# EAGLE design ws2812-attiny (EAGLE 7.7.0)
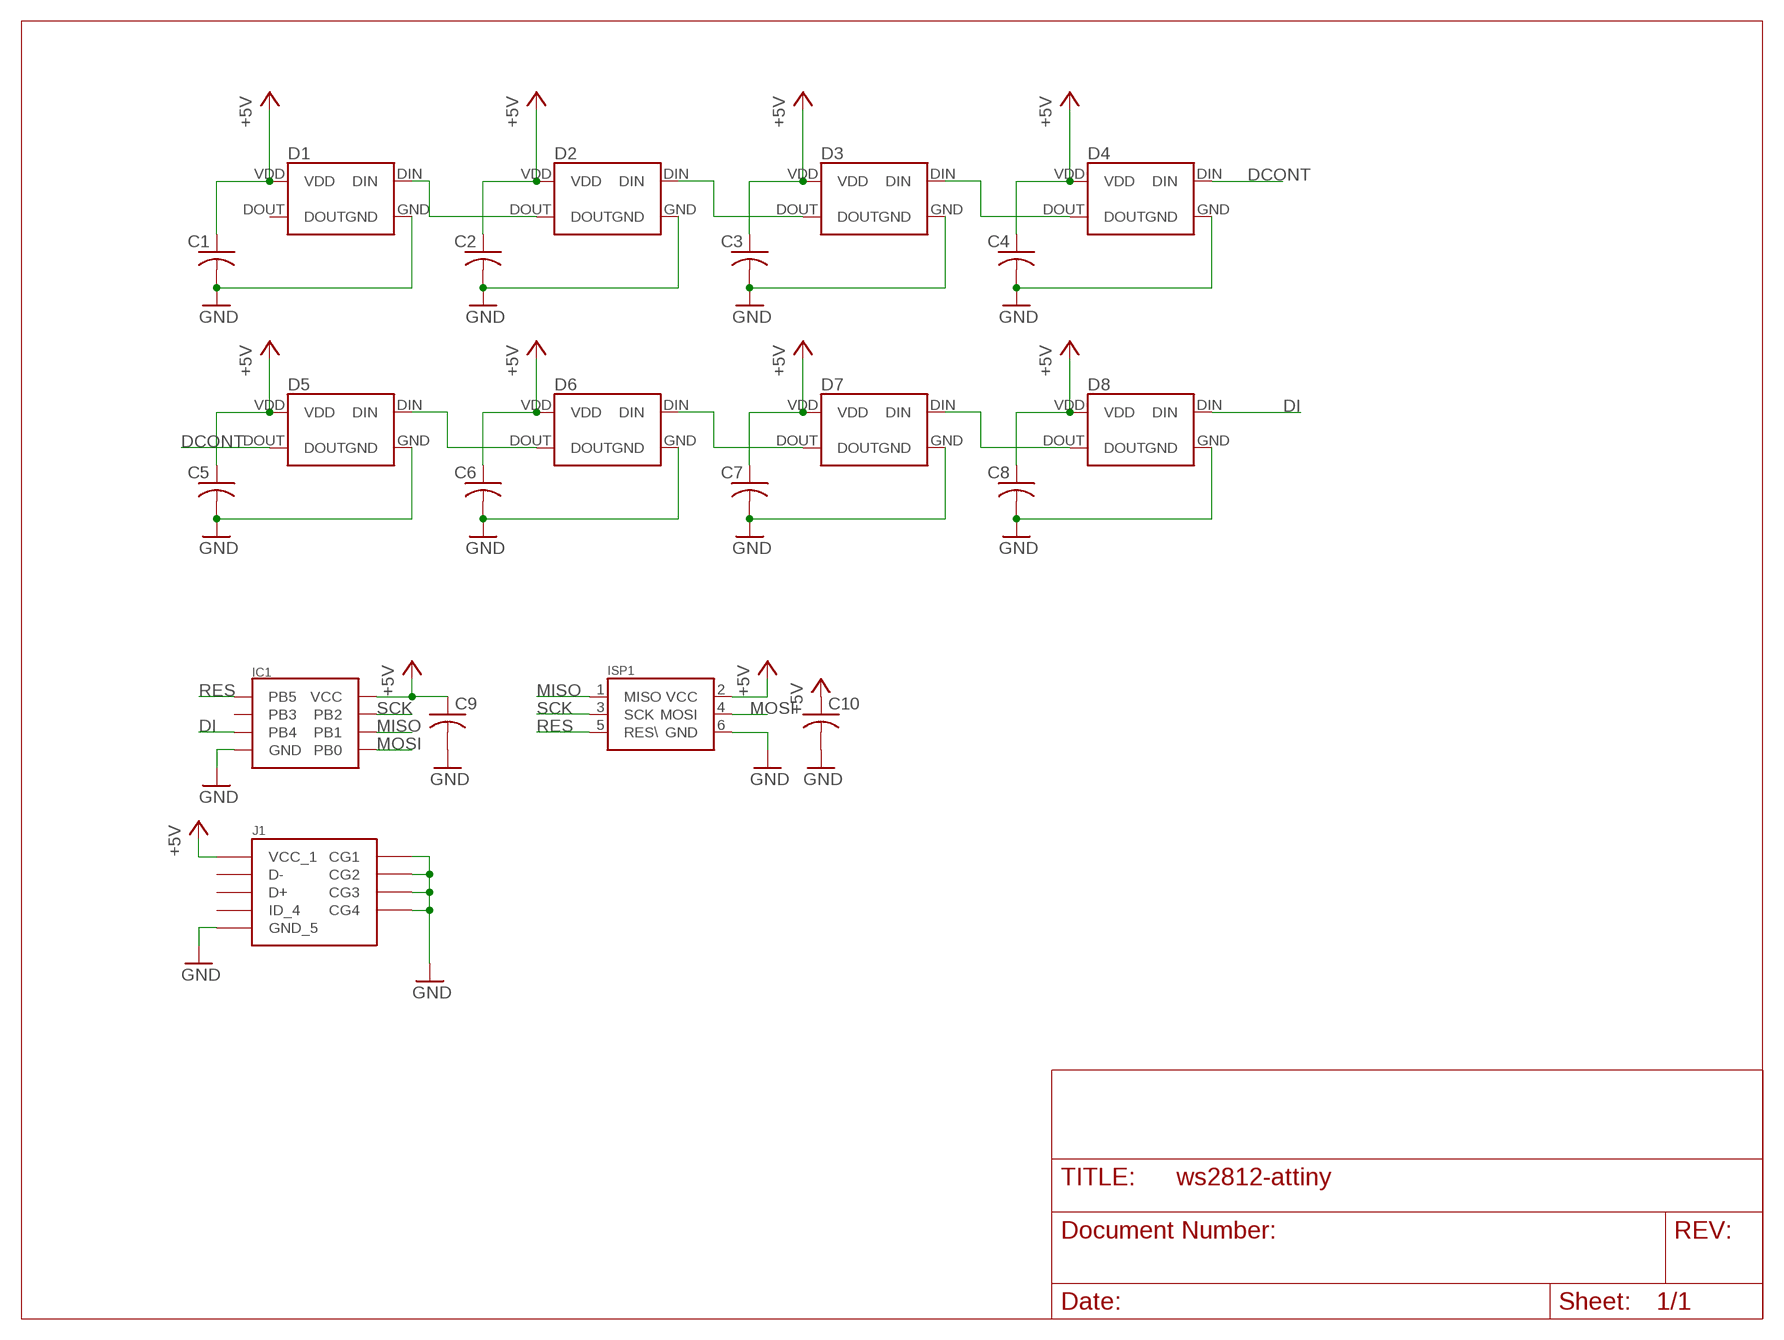
[diagram p0: schematic, sheet 1]

## Parts
C1  C-USC1206  [C1206]
C2  C-USC1206  [C1206]
C3  C-USC1206  [C1206]
C4  C-USC1206  [C1206]
C5  C-USC1206  [C1206]
C6  C-USC1206  [C1206]
C7  C-USC1206  [C1206]
C8  C-USC1206  [C1206]
C9  C-USC1206  [C1206]
C10  C-USC1206  [C1206]
D1  WS2812B  [WS2812B]
D2  WS2812B  [WS2812B]
D3  WS2812B  [WS2812B]
D4  WS2812B  [WS2812B]
D5  WS2812B  [WS2812B]
D6  WS2812B  [WS2812B]
D7  WS2812B  [WS2812B]
D8  WS2812B  [WS2812B]
IC1  ATTINY85  [ATTINY-8S2]
ISP1  ISP-HEADER  [2X03]
J1  USB_JAE_DX4R005HJ5R2000  [USB_JAE_DX4R005HJ5R2000]

## Nets
+5V: C1.1 C2.1 C3.1 C4.1 C5.1 C6.1 C7.1 C8.1 C9.1 C10.1 D1.VDD D2.VDD D3.VDD D4.VDD D5.VDD D6.VDD D7.VDD D8.VDD IC1.8(VCC) ISP1.2(VCC) J1.P$1(VCC_1)
DCONT: D4.DIN D5.DOUT
DI: D8.DIN IC1.3(PB4)
GND: C1.2 C2.2 C3.2 C4.2 C5.2 C6.2 C7.2 C8.2 C9.2 C10.2 D1.GND D2.GND D3.GND D4.GND D5.GND D6.GND D7.GND D8.GND IC1.4(GND) ISP1.6(GND) J1.P$5(GND_5) J1.P$6(CG4) J1.P$7(CG3) J1.P$8(CG2) J1.P$9(CG1)
MISO: IC1.6(PB1) ISP1.1(MISO)
MOSI: IC1.5(PB0) ISP1.4(MOSI)
N$1: D7.DIN D8.DOUT
N$2: D1.DIN D2.DOUT
N$3: D2.DIN D3.DOUT
N$4: D3.DIN D4.DOUT
N$7: D5.DIN D6.DOUT
N$8: D6.DIN D7.DOUT
RES: IC1.1(PB5) ISP1.5(RES\)
SCK: IC1.7(PB2) ISP1.3(SCK)
Unconnected: D1.DOUT IC1.2(PB3) J1.P$2(D-) J1.P$3(D+) J1.P$4(ID_4)

## Library data of the parts
C1-C10 = rcl:C-US: CAPACITOR, American symbol
D1-D8 = phils:WS2812B
IC1 = phils:ATTINY85
ISP1 = phils:ISP-HEADER: Atmel AVR ISP Header
J1 = phils:USB_JAE_DX4R005HJ5R2000

## Board
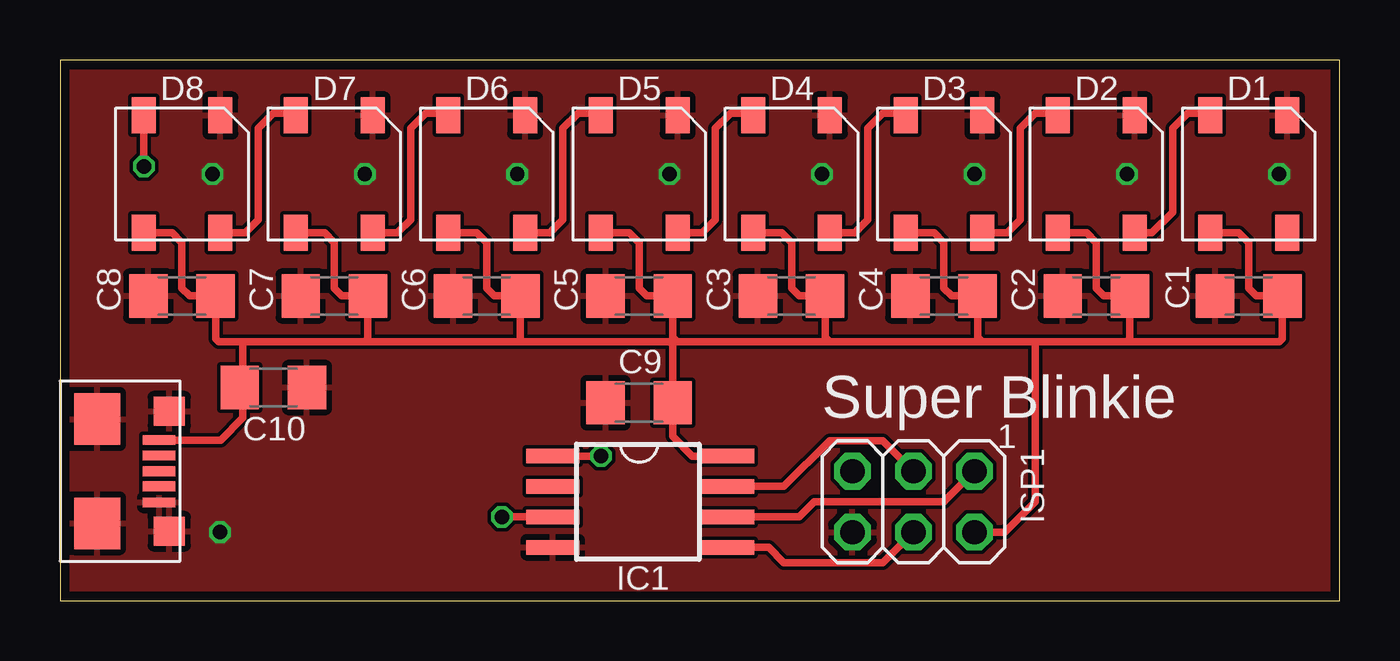
[diagram p1: board, top side]
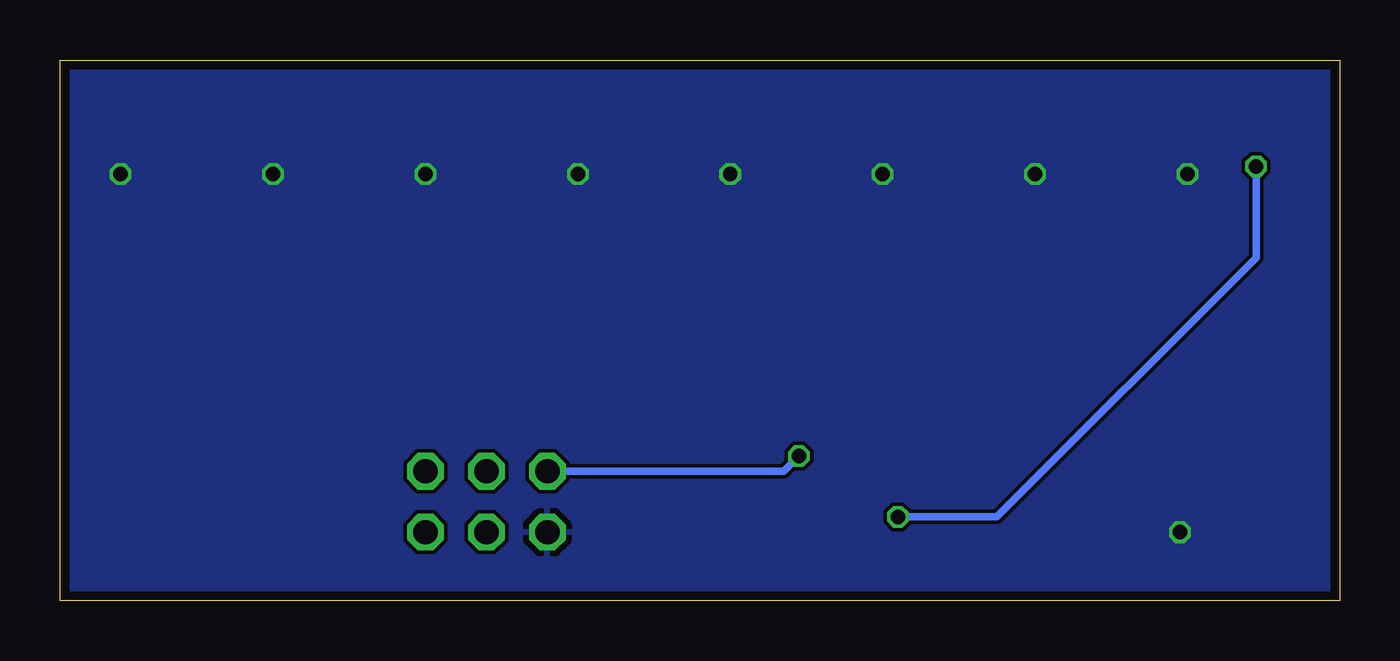
[diagram p2: board, bottom side, seen from below]

Size 53.33 x 22.53 mm. Coordinates in mm from the lower left corner, seen from the top.
Outline: 0,0 53.33,0 53.33,22.53 0,22.53 0,0
Copper layers (1*16): Top 0.035559375mm / dielectric 1.6mm / Bottom 0.035559375mm
Design rules "oshpark-2layer": minimum track width 6mil, minimum drill 10mil, track to track 6mil, track to pad 6mil, pad to pad 6mil, via to via 6mil, smd to smd 6mil, copper to edge 15mil, drill to drill 6mil, minimum pad ring 5mil, minimum via ring 5mil, stop-mask expansion 2.5mil, vias tented up to drill 0mil, thermal gap 10mil

### Footprints (pad centres in the part's own frame; a part is rotated, then mirrored left to right if it is on the bottom)
C1206 = smd 1.6 x 1.8: 1 -1.4,0; 2 1.4,0
WS2812B = smd 1.5 x 1: DIN 2.45,1.6; DOUT -2.45,-1.6; GND 2.45,-1.6; VDD -2.45,1.6
ATTINY-8S2 = smd 0.6 x 2.2: 1 -1.905,-3.6; 2 -0.635,-3.6; 3 0.635,-3.6; 4 1.905,-3.6; 5 1.905,3.7; 6 0.635,3.7; 7 -0.635,3.7; 8 -1.905,3.7
2X03 = drill 1.016 octagon: 1 -2.54,-1.27; 2 -2.54,1.27; 3 0,-1.27; 4 0,1.27; 5 2.54,-1.27; 6 2.54,1.27
USB_JAE_DX4R005HJ5R2000 = smd 0.4 x 1.35: P$1 -1.3,4.125; P$2 -0.65,4.125; P$3 0,4.125; P$4 0.625,4.125; P$5 1.3,4.125 | smd 1.2 x 1.3: P$6 -2.5,4.55; P$7 2.5,4.55 | smd 2.15 x 1.9: P$8 -2.175,1.55; P$9 2.175,1.55

### Placement (x,y rotation side)
C1  49.53,12.7 180 top
C2  43.18,12.7 180 top
C3  30.48,12.7 180 top
C4  36.83,12.7 180 top
C5  24.13,12.7 180 top
C6  17.78,12.7 180 top
C7  11.43,12.7 180 top
C8  5.08,12.7 180 top
C9  24.13,8.26 180 top
C10  8.89,8.89 0 top
D1  49.53,17.78 90 top
D2  43.18,17.78 90 top
D3  36.83,17.78 90 top
D4  30.48,17.78 90 top
D5  24.13,17.78 90 top
D6  17.78,17.78 90 top
D7  11.43,17.78 90 top
D8  5.08,17.78 90 top
IC1  24.13,4.13 270 top
ISP1  35.56,4.13 180 top
J1  0,5.4 270 top

### Tracks (layer width: path | path; a pad name or v marks a point on that pad's centre or on a via)
+5V
  Top 0.305: 7.62,10.79 12.7,10.79 | 12.7,10.79 19.18,10.79 | 19.18,10.79 25.4,10.79 | 25.4,10.79 25.72,10.79 | 25.72,10.79 32.07,10.79 | 32.07,10.79 38.42,10.79 | 38.42,10.79 40.64,10.79 | 40.64,10.79 44.45,10.79 | 44.45,10.79 50.8,10.79 50.93,10.93 C1.1 49.85,12.7 49.53,13.02 49.53,14.92 49.12,15.33 D1.VDD | 44.45,10.79 44.58,10.93 C2.1 43.5,12.7 43.18,13.02 43.18,14.92 42.77,15.33 D2.VDD | 38.42,10.79 38.23,10.98 C4.1 37.15,12.7 36.83,13.02 36.83,14.92 36.42,15.33 D3.VDD | 32.07,10.79 31.88,10.98 C3.1 30.8,12.7 30.48,13.02 30.48,14.92 30.07,15.33 D4.VDD | 25.72,10.79 25.53,10.98 C5.1 24.45,12.7 24.13,13.02 24.13,14.92 23.72,15.33 D5.VDD | D7.VDD 11.02,15.33 11.43,14.92 11.43,13.02 11.75,12.7 C7.1 12.83,10.93 12.7,10.79 | D6.VDD 17.37,15.33 17.78,14.92 17.78,13.02 18.1,12.7 C6.1 19.18,10.79 | ISP1.2 39.37,2.86 40.64,4.13 40.64,10.79 | J1.P$1 6.7,6.7 7.62,7.62 7.62,8.89 | 7.62,8.89 7.62,10.79 | 7.62,10.79 6.61,10.79 6.48,10.93 C8.1 5.4,12.7 5.08,13.02 5.08,14.92 4.67,15.33 D8.VDD | 25.4,10.79 25.53,10.66 C9.1 25.53,6.86 26.35,6.03 IC1.8 | C10.1 7.62,8.89
DCONT
  Top 0.305: D5.DOUT 26.76,15.33 27.3,15.88 27.3,19.68 27.94,20.32 28.79,20.32 D4.DIN
DI  (via drill 0.6)
  Top 0.305: 3.49,20.22 D8.DIN v3.48,18.11 v3.49,18.1 | IC1.3 v18.41,3.49
  Bottom 0.305: v3.49,18.1 3.49,14.29 14.29,3.49 v18.41,3.49
GND  (via drill 0.6)
  other vias: 6.35,17.78 12.7,17.78 19.05,17.78 25.4,17.78 31.75,17.78 38.1,17.78 44.45,17.78 50.8,17.78 6.67,2.86
  pour Top: 0,0 72.39,0 72.39,26.67 0,26.67
  pour Bottom: 0,0 74.93,0 74.93,25.4 0,25.4
MISO
  Top 0.305: IC1.6 30.8,3.49 31.43,4.13 36.83,4.13 ISP1.1
MOSI
  Top 0.305: ISP1.4 34.29,1.59 30.16,1.59 29.53,2.22 IC1.5
N$1
  Top 0.305: D8.DOUT 7.71,15.33 8.26,15.88 8.26,19.68 8.89,20.32 9.74,20.32 D7.DIN
N$2
  Top 0.305: D2.DOUT 45.49,15.33 46.35,16.19 46.35,19.68 46.99,20.32 47.84,20.32 D1.DIN
N$3
  Top 0.305: D3.DOUT 39.46,15.33 40.01,15.88 40.01,19.68 40.64,20.32 41.49,20.32 D2.DIN
N$4
  Top 0.305: D4.DOUT 33.11,15.33 33.66,15.88 33.66,19.68 34.29,20.32 35.14,20.32 D3.DIN
N$7
  Top 0.305: D6.DOUT 20.41,15.33 20.95,15.88 20.95,19.68 21.59,20.32 22.44,20.32 D5.DIN
N$8
  Top 0.305: D7.DOUT 14.06,15.33 14.61,15.88 14.61,19.68 15.24,20.32 16.09,20.32 D6.DIN
RES  (via drill 0.6)
  Top 0.305: v22.54,6.03 IC1.1
  Bottom 0.305: ISP1.5 23.18,5.4 v22.54,6.03
SCK
  Top 0.305: IC1.7 30.16,4.76 32.07,6.67 34.29,6.67 ISP1.3

### Text on the board
tPlace: Super Blinkie | 1